# Altium schematic sheet Gain.SchDoc
size A4; SheetNumber: 1; SheetTotal: 1
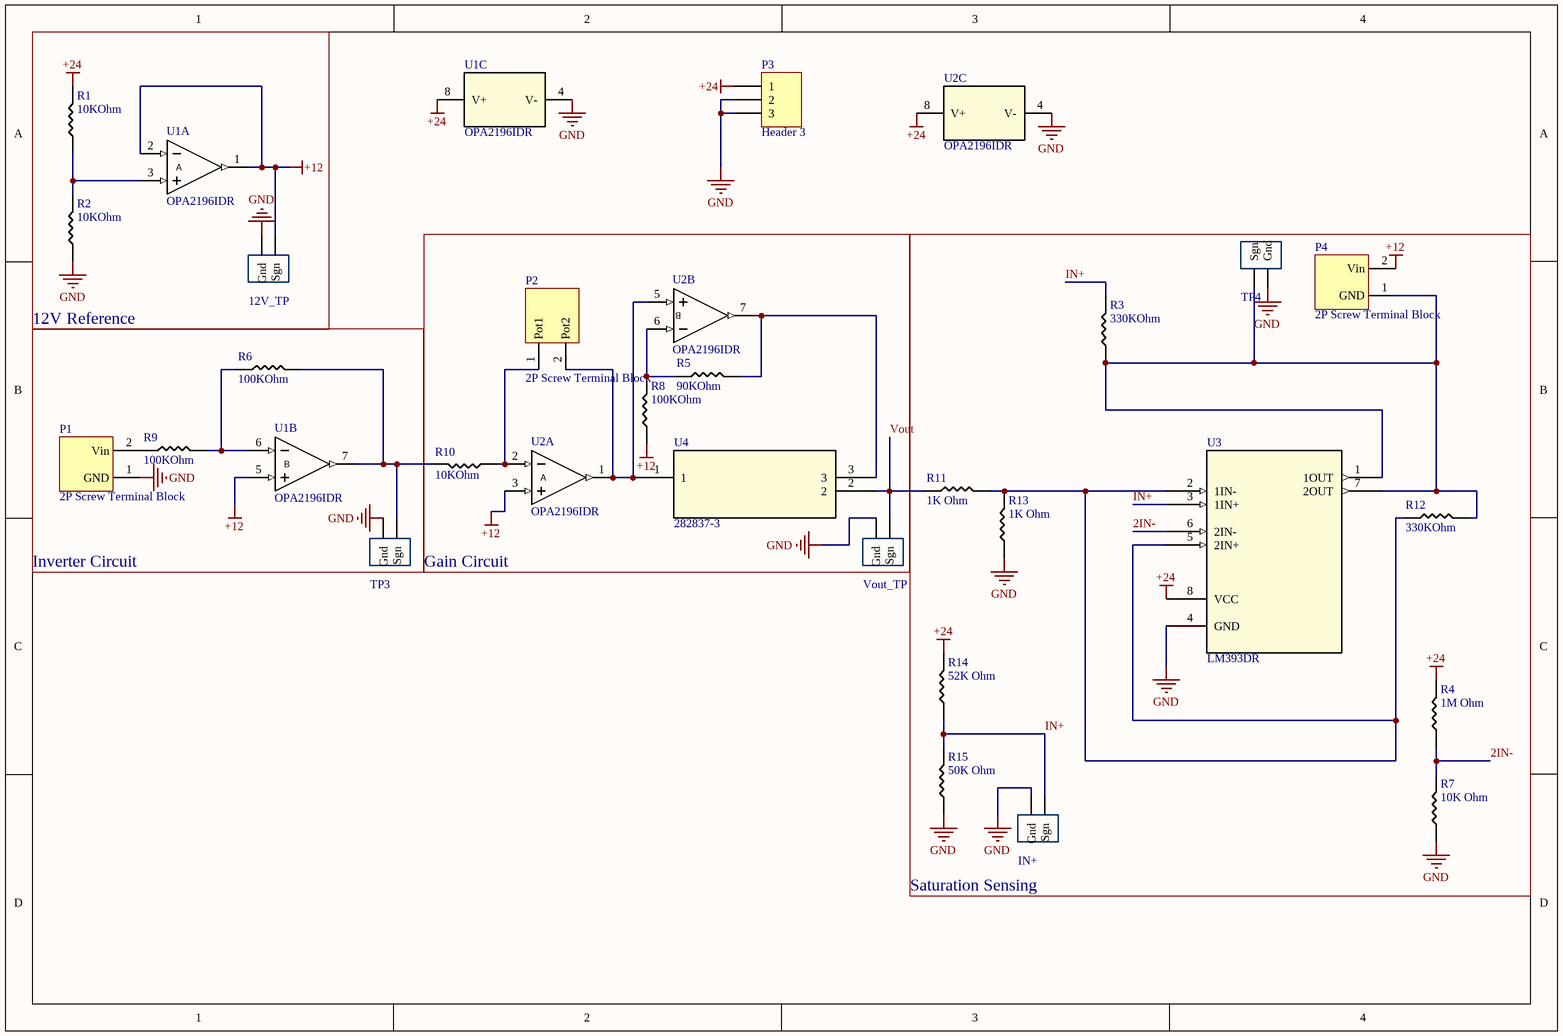
[diagram p0: Gain.SchDoc]

## Parts
12V_TP  10x Probe TP  [TP10x_Probe]  (value not drawn)
IN+  10x Probe TP  [TP10x_Probe]  (value not drawn)
P1  2P Screw Terminal Block  [P_Terminal block 3.5mm-pitch]
P2  2P Screw Terminal Block  [P_Terminal block 3.5mm-pitch]
P3  Header 3  [HDR1X3]
P4  2P Screw Terminal Block  [P_Terminal block 3.5mm-pitch]
R1  value 10KOhm  [1206_Passive_Resitor]  (hidden comment: 10k)
R2  value 10KOhm  [1206_Passive_Resitor]  (hidden comment: 10k)
R3  value 330KOhm  [1206_Passive_Resitor]  (hidden comment: 300 Ohm)
R4  value 1M Ohm  [1206_Passive_Resitor]  (hidden comment: 1k)
R5  90KOhm  [1206_Passive_Resitor]
R6  100KOhm  [1206_Passive_Resitor]
R7  value 10K Ohm  [1206_Passive_Resitor]  (hidden comment: 1k)
R8  100KOhm  [1206_Passive_Resitor]
R9  100KOhm  [1206_Passive_Resitor]
R10  value 10KOhm  [1206_Passive_Resitor]  (hidden comment: 10k)
R11  value 1K Ohm  [1206_Passive_Resitor]  (hidden comment: 1k)
R12  value 330KOhm  [1206_Passive_Resitor]  (hidden comment: 300 Ohm)
R13  value 1K Ohm  [1206_Passive_Resitor]  (hidden comment: 1k)
R14  value 52K Ohm  [1206_Passive_Resitor]  (hidden comment: 1k)
R15  value 50K Ohm  [1206_Passive_Resitor]  (hidden comment: 1k)
TP3  10x Probe TP  [TP10x_Probe]  (value not drawn)
TP4  10x Probe TP  [TP10x_Probe]  (value not drawn)
U1  OPA2196IDR  [D0008A_N]  (parts A,B,C of 3)
U2  OPA2196IDR  [D0008A_N]  (parts A,B,C of 3)
U3  LM393DR  [D8]
U4  282837-3  [282837-3_TYC]
Vout_TP  10x Probe TP  [TP10x_Probe]  (value not drawn)

## Blocks framed on the sheet
12V Reference: 12V_TP R1 R2 U1
Gain Circuit: P2 R5 R8 R10 U2 U4 Vout_TP
Saturation Sensing: IN+ P4 R3 R4 R7 R11-R15 TP4 U3
Inverter Circuit: P1 R6 R9 TP3 U1

## Nets
+12: 12V_TP.1(Sgn) P4.2(Vin) R8.1 U1.1(OUT) U1.2(IN-) U1.5(IN+) U2.3(IN+)
+24: P3.1 R1.2 R4.2 R14.2 U1.8(V+) U2.8(V+) U3.8(VCC)
GND: 12V_TP.2(Gnd) IN+.2(Gnd) P1.1(GND) P3.2 P3.3 R2.1 R7.1 R13.1 R15.1 TP3.2(Gnd) TP4.2(Gnd) U1.4(V-) U2.4(V-) U3.4(GND) Vout_TP.2(Gnd)
2IN-: R4.1 R7.2 U3.6(2IN-)
IN+: IN+.1(Sgn) R3.2 R14.1 R15.2 U3.3(1IN+)
Vout: R11.1 U4.2 Vout_TP.1(Sgn)
NetP1_2: P1.2(Vin) R9.1
NetP2_1: P2.1(Pot1) R10.1 U2.2(IN-)
NetP2_2: P2.2(Pot2) U2.1(OUT) U2.5(IN+) U4.1
NetP4_1: P4.1(GND) R3.1 R12.2 TP4.1(Sgn) U3.1(1OUT) U3.7(2OUT)
NetR1_1: R1.1 R2.2 U1.3(IN+)
NetR5_1: R5.1 R8.2 U2.6(IN-)
NetR5_2: R5.2 U2.7(OUT) U4.3
NetR6_1: R6.1 R9.2 U1.6(IN-)
NetR6_2: R6.2 R10.2 TP3.1(Sgn) U1.7(OUT)
NetR11_2: R11.2 R12.1 R13.2 U3.2(1IN-) U3.5(2IN+)

## Notes on the sheet
- (in symbol OPA2196IDR, part A) A
- (in symbol OPA2196IDR, part B) B

## Library data of the parts
12V_TP IN+ TP3 TP4 Vout_TP = TP_10x_Probe: Test Point 300 mil centers
P1 P2 P4 = P_Terminal block: Green Straight pin 3.5mm  pitch; P=3.5mm  Screw terminal ROHS; MFR Part #: KF350-3.5-2P; Manufacturer: Cixi Kefa Elec; LCSC Part#: C474892; DataSheet: https://datasheet.lcsc.com/lcsc/2001160007_Cixi-Kefa-Elec-KF350-3-5-2P_C474892.pdf
P3 = Header 3: Header, 3-Pin; LatestRevisionDate: 17-Jul-2002; LatestRevisionNote: Re-released for DXP Platform.; Publisher: Altium Limited
R1 R2 R10 = R_10KOhm_1206: 10 kOhms ±5% 0.25W, 1/4W Chip Resistor 1206 (3216 Metric) Automotive AEC-Q200 Thick Film; MFR Part #: RMCF1206FT10K0; Digikey Link: https://www.digikey.com/en/products/detail/stackpole-electronics-inc/RMCF1206FT10K0/1759669; LCSC Part#: C17902; Type: Basic
R3 R12 = R_300Ohm_1206: CHIP RESISTOR - SURFACE MOUNT 300OHMS ±1% 1/4W 1206 ROHS; MFR Part #: 1206W4F3000T5E; Datasheet: https://datasheet.lcsc.com/szlcsc/Uniroyal-Elec-1206W4F3000T5E_C17887.pdf; LCSC Part#: C17887; Type: Basic
R4 R7 R11 R13-R15 = R_1K_1206: CHIP RESISTOR - SURFACE MOUNT 1KOHMS ±1% 1/4W 1206 ROHS; MFR Part #: RNCP1206FTD1K00CT; Digikey Link: https://www.digikey.com/product-detail/en/RNCP1206FTD1K00/RNCP1206FTD1K00CT-ND/2240675/?itemSeq=304982373; LCSC Part#: C4410; Type: Basic
R5 R6 R8 R9 = R_100KOhm_1206: 100kΩ ±1% 0.25W ±100ppm/℃ 1206 Chip Resistor - Surface Mount RoHS; MFR Part #: 1206W4F1003T5E; LCSC Part#: C17900; Datasheet: https://datasheet.lcsc.com/lcsc/1810301421_UNI-ROYAL-Uniroyal-Elec-1206W4F1003T5E_C17900.pdf; Type: Basic
  R5: Value: 90KOhm
  R6 R8 R9: Value: 100KOhm
U1 U2 = OPA2196IDR: Dual, 36-V, low power, all-purpose amplifier with mux-friendly input 8-SOIC -40 to 125; Manufacturer_Name: Texas Instruments; TYPE: TYPE; RefDes: RefDes; Copyright: Copyright (C) 2026 Ultra Librarian. All rights reserved.; Manufacturer_Part_Number: OPA2196IDR; Datasheet: https://www.ti.com/lit/gpn/opa2196
U3 = LM393DR: Dual differential comparator, commercial grade 8-SOIC 0 to 70; Manufacturer_Name: Texas Instruments; Copyright: Copyright (C) 2025 Ultra Librarian. All rights reserved.; Manufacturer_Part_Number: LM393DR; RefDes: RefDes; Type: Type
U4 = 282837-3: TERMI-BLOK PCB MOUNT 3P; Manufacturer_Name: TE Connectivity; Copyright: Copyright (C) 2025 Ultra Librarian. All rights reserved.; Manufacturer_Part_Number: 282837-3; RefDes: RefDes; Type: Type